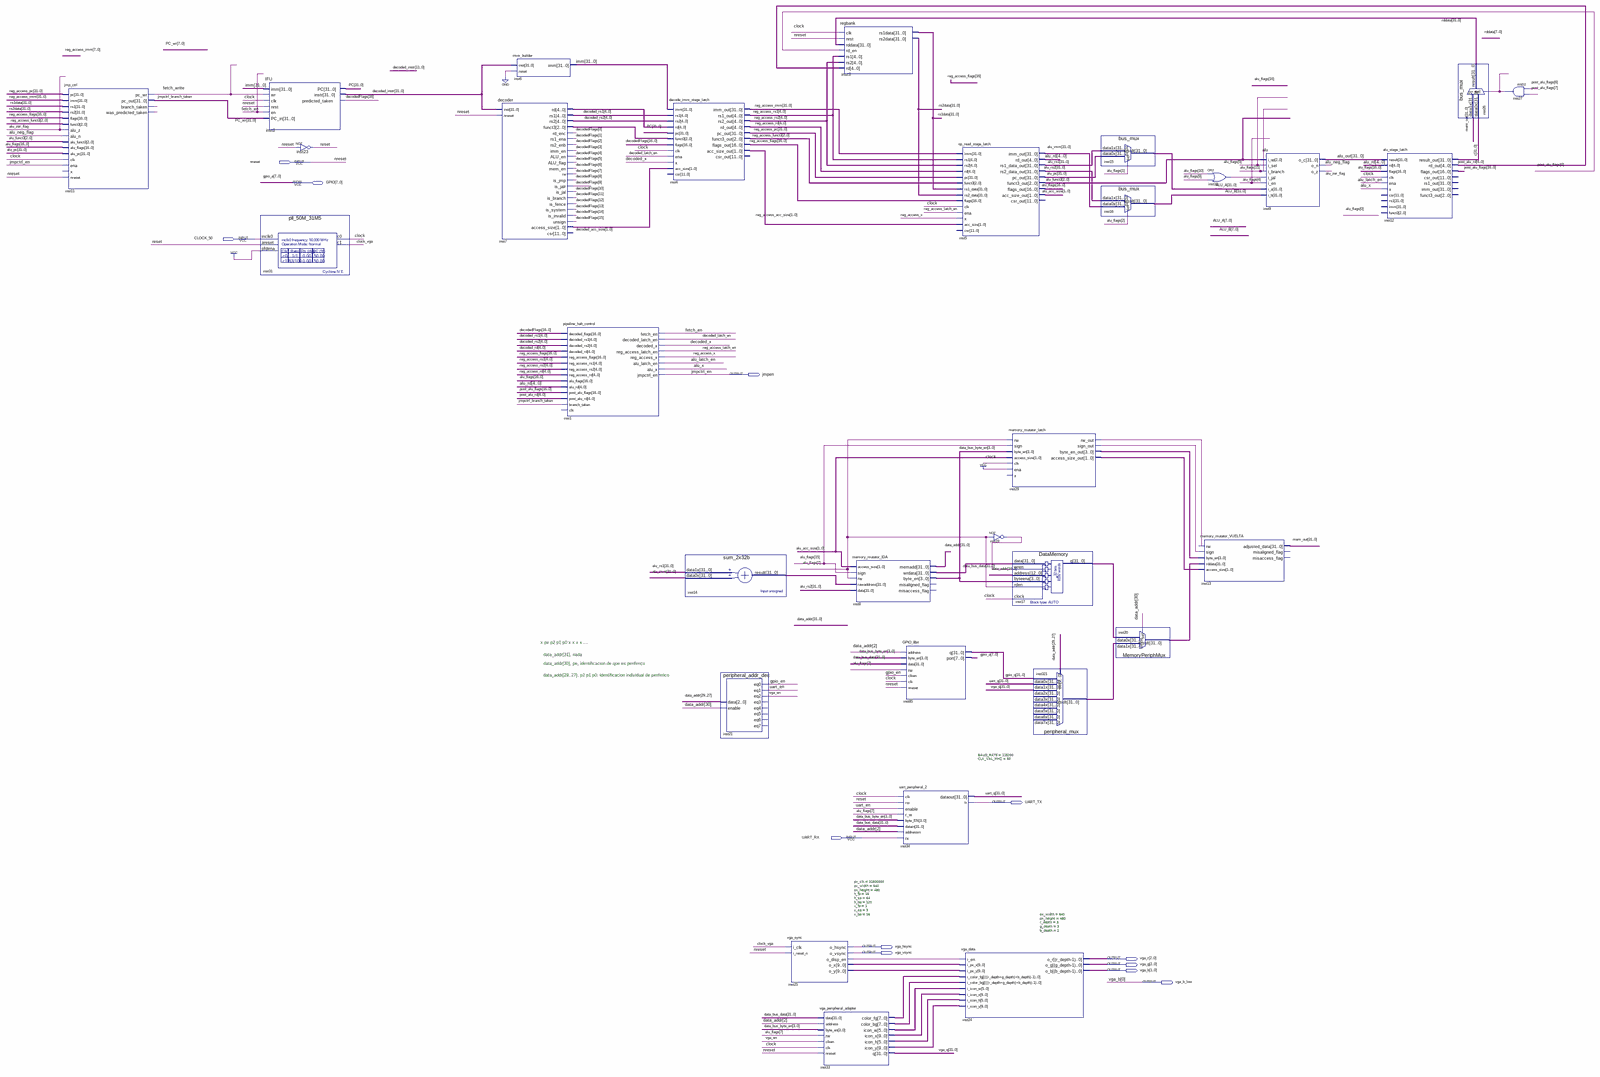
[diagram p0: schematic sheet, whole]
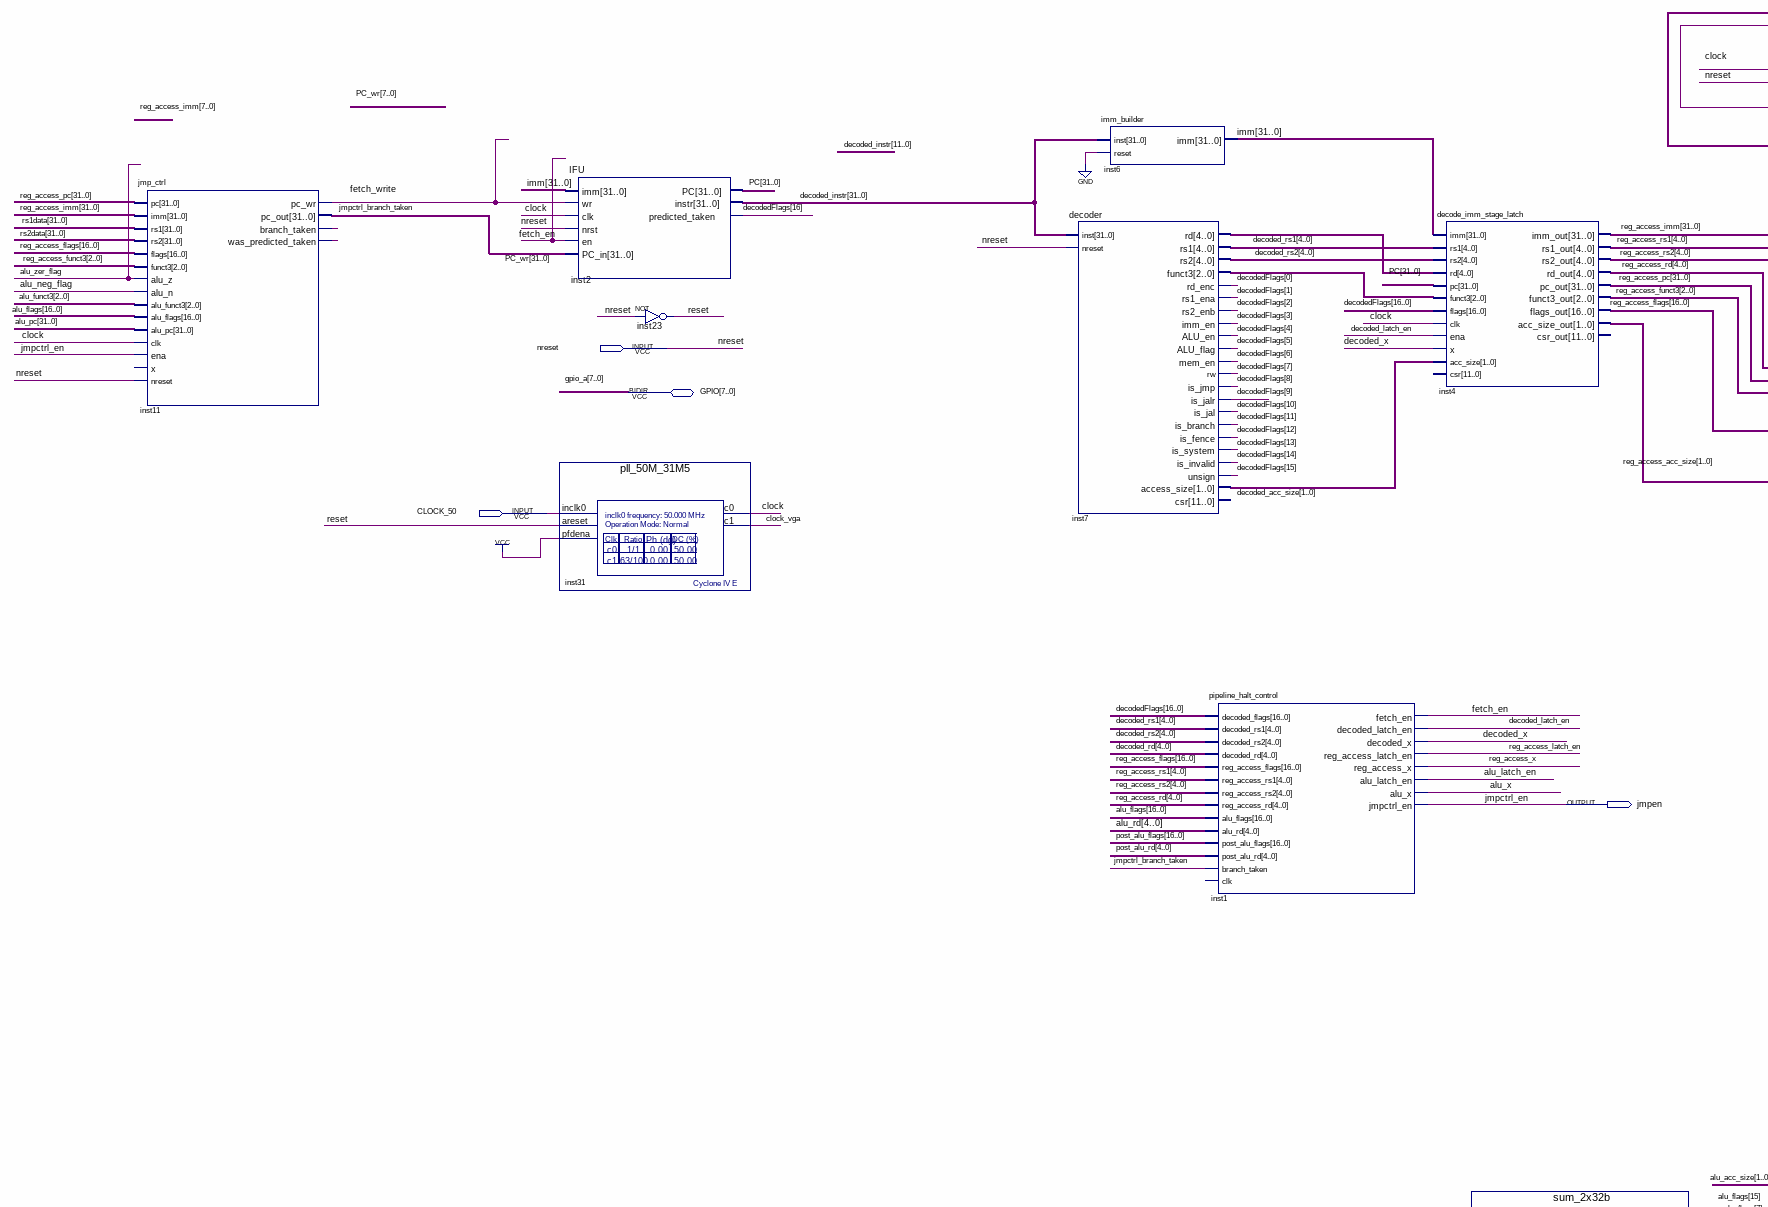
[diagram p1: schematic sheet, upper left part]
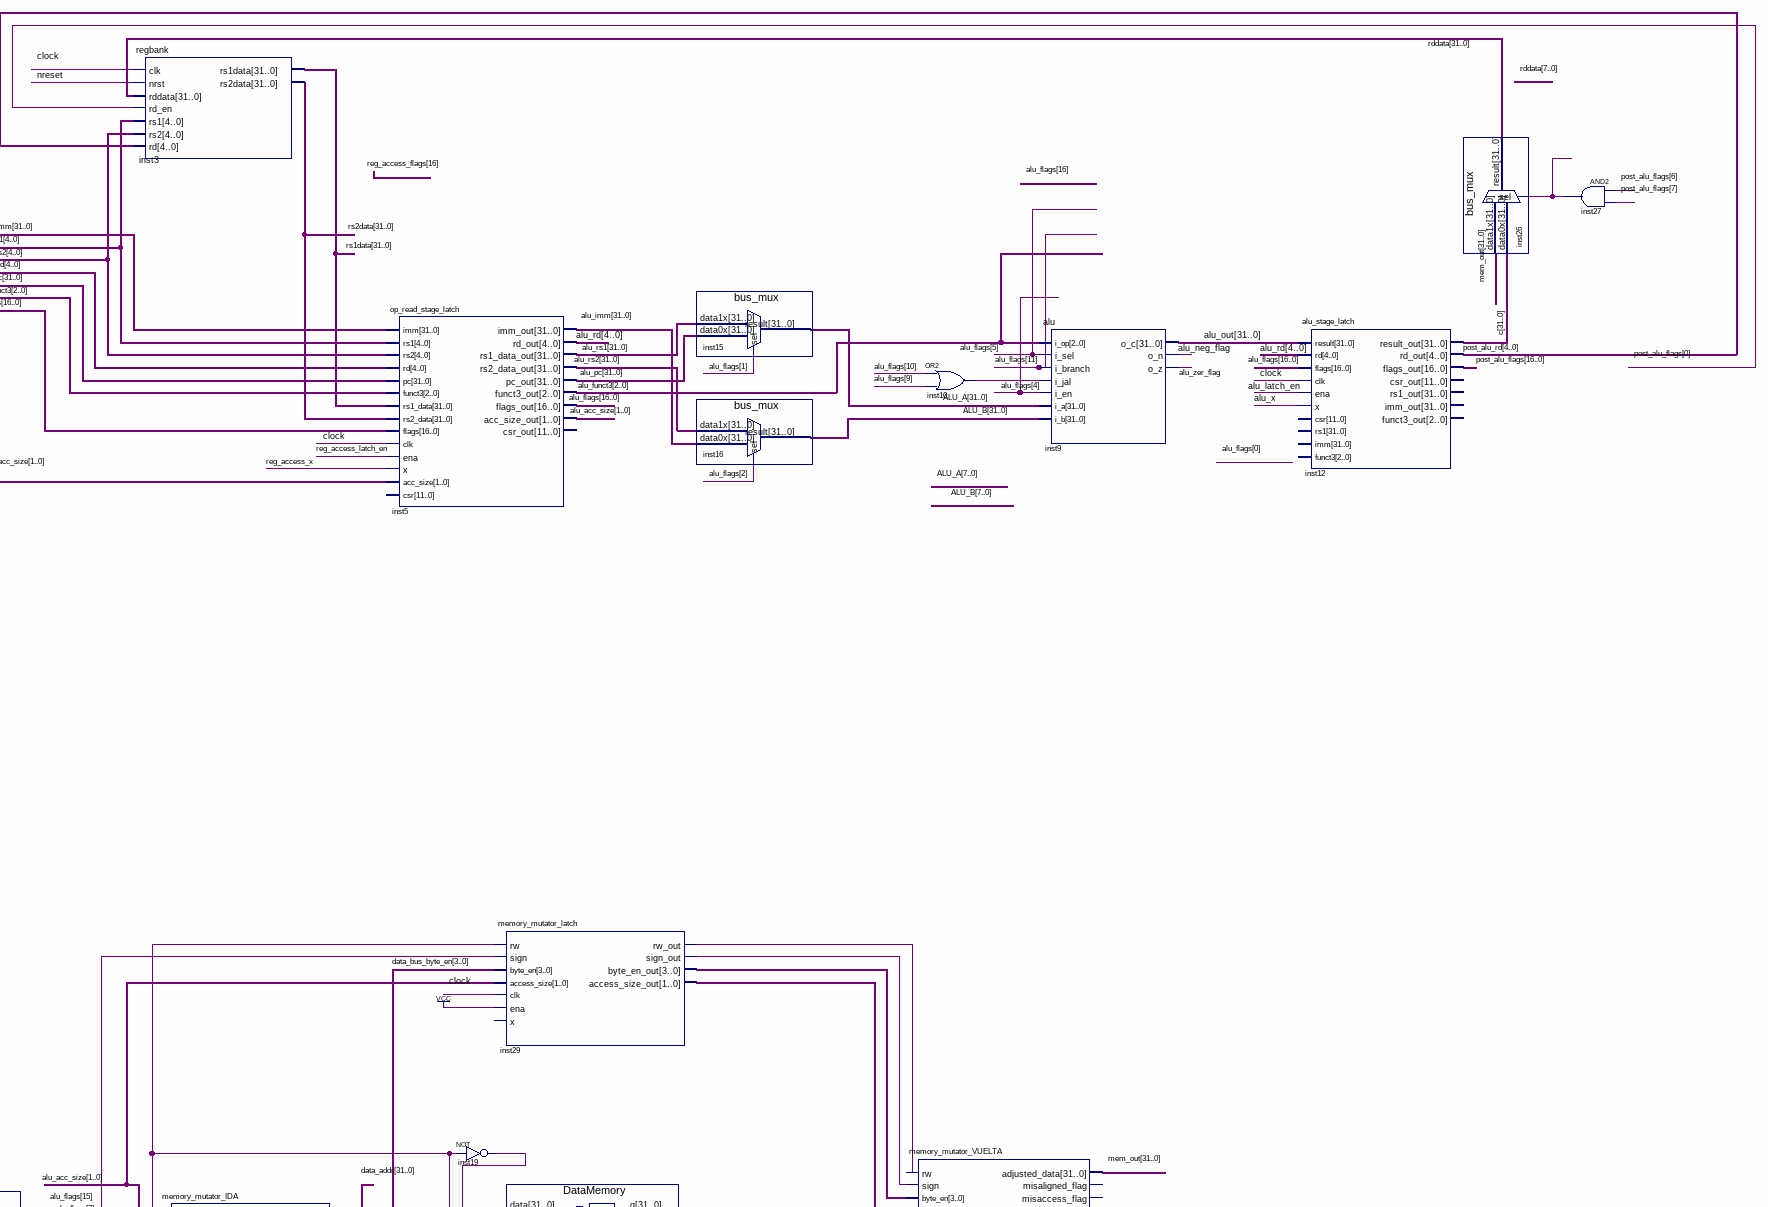
[diagram p2: schematic sheet, upper right part]
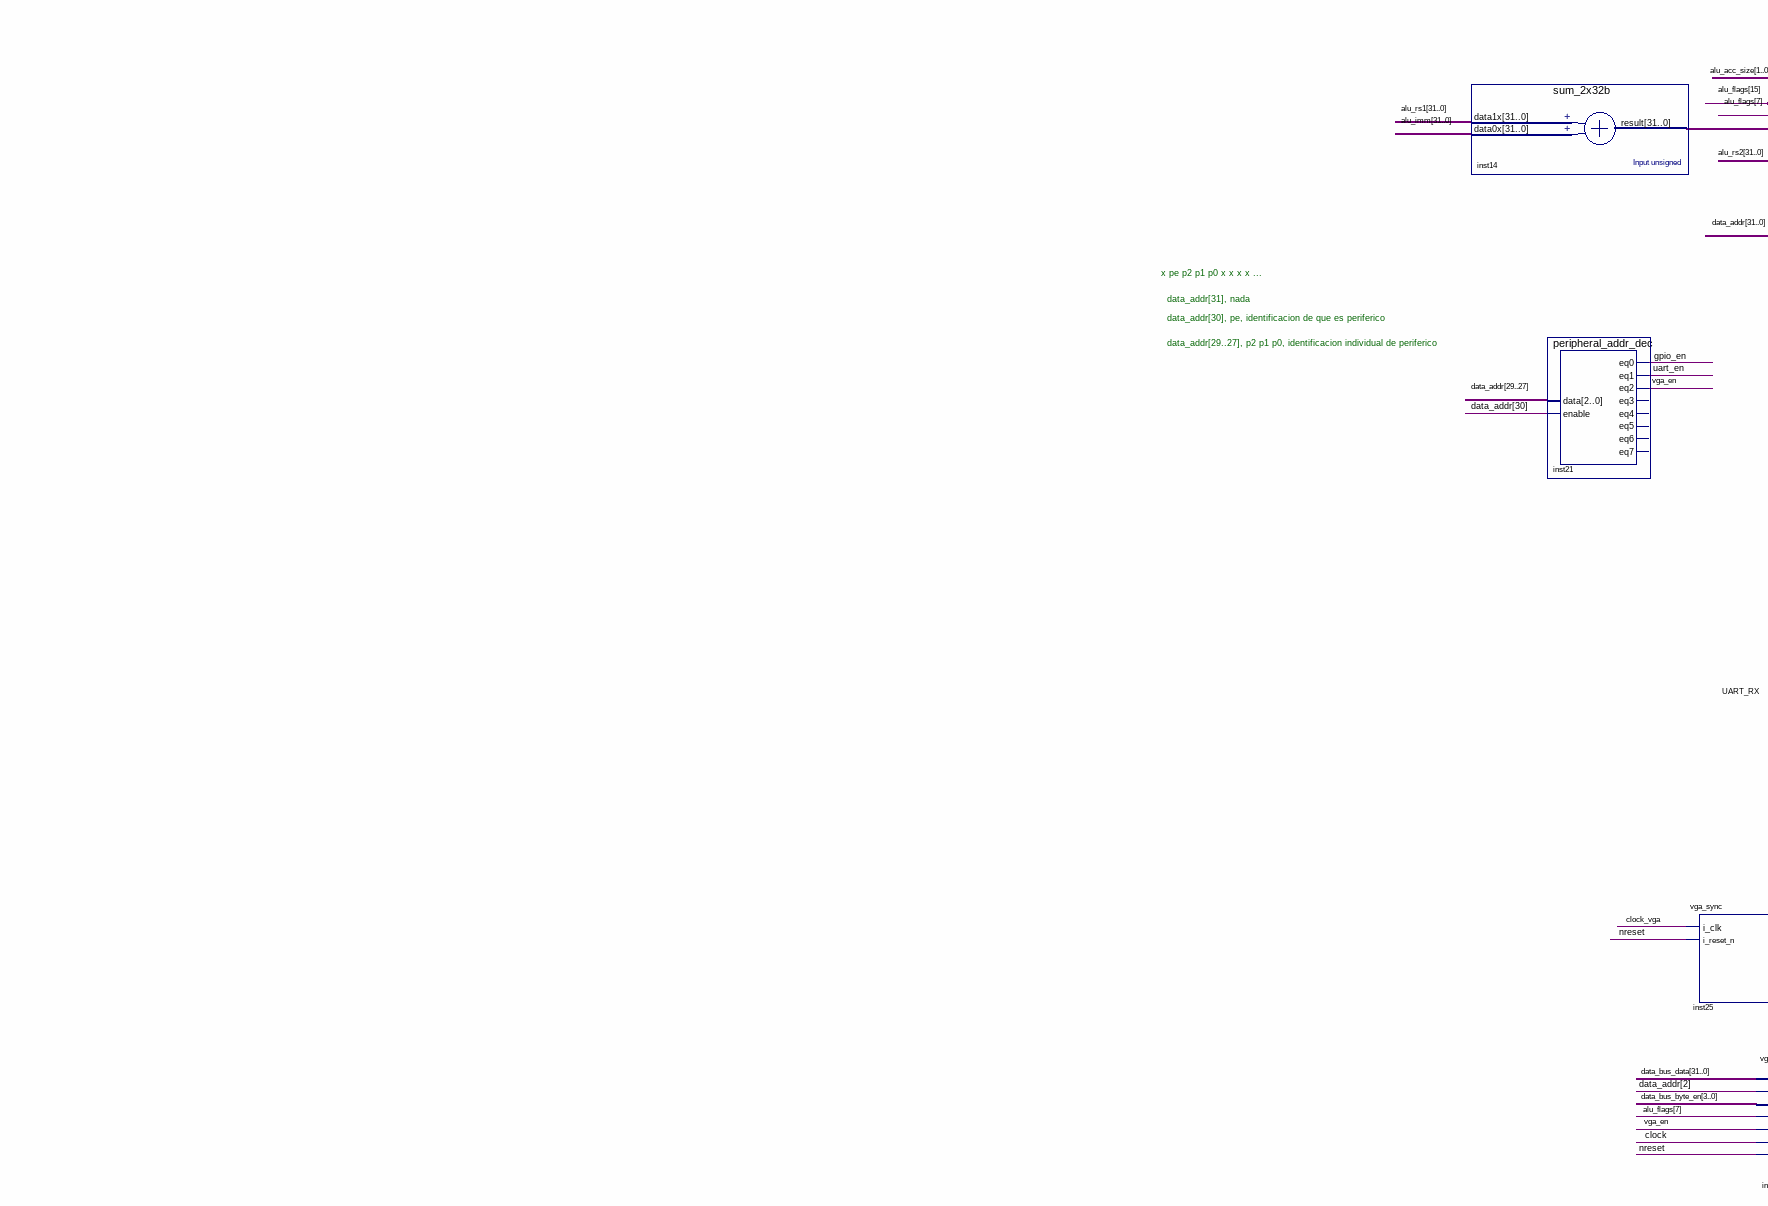
[diagram p3: schematic sheet, lower left part]
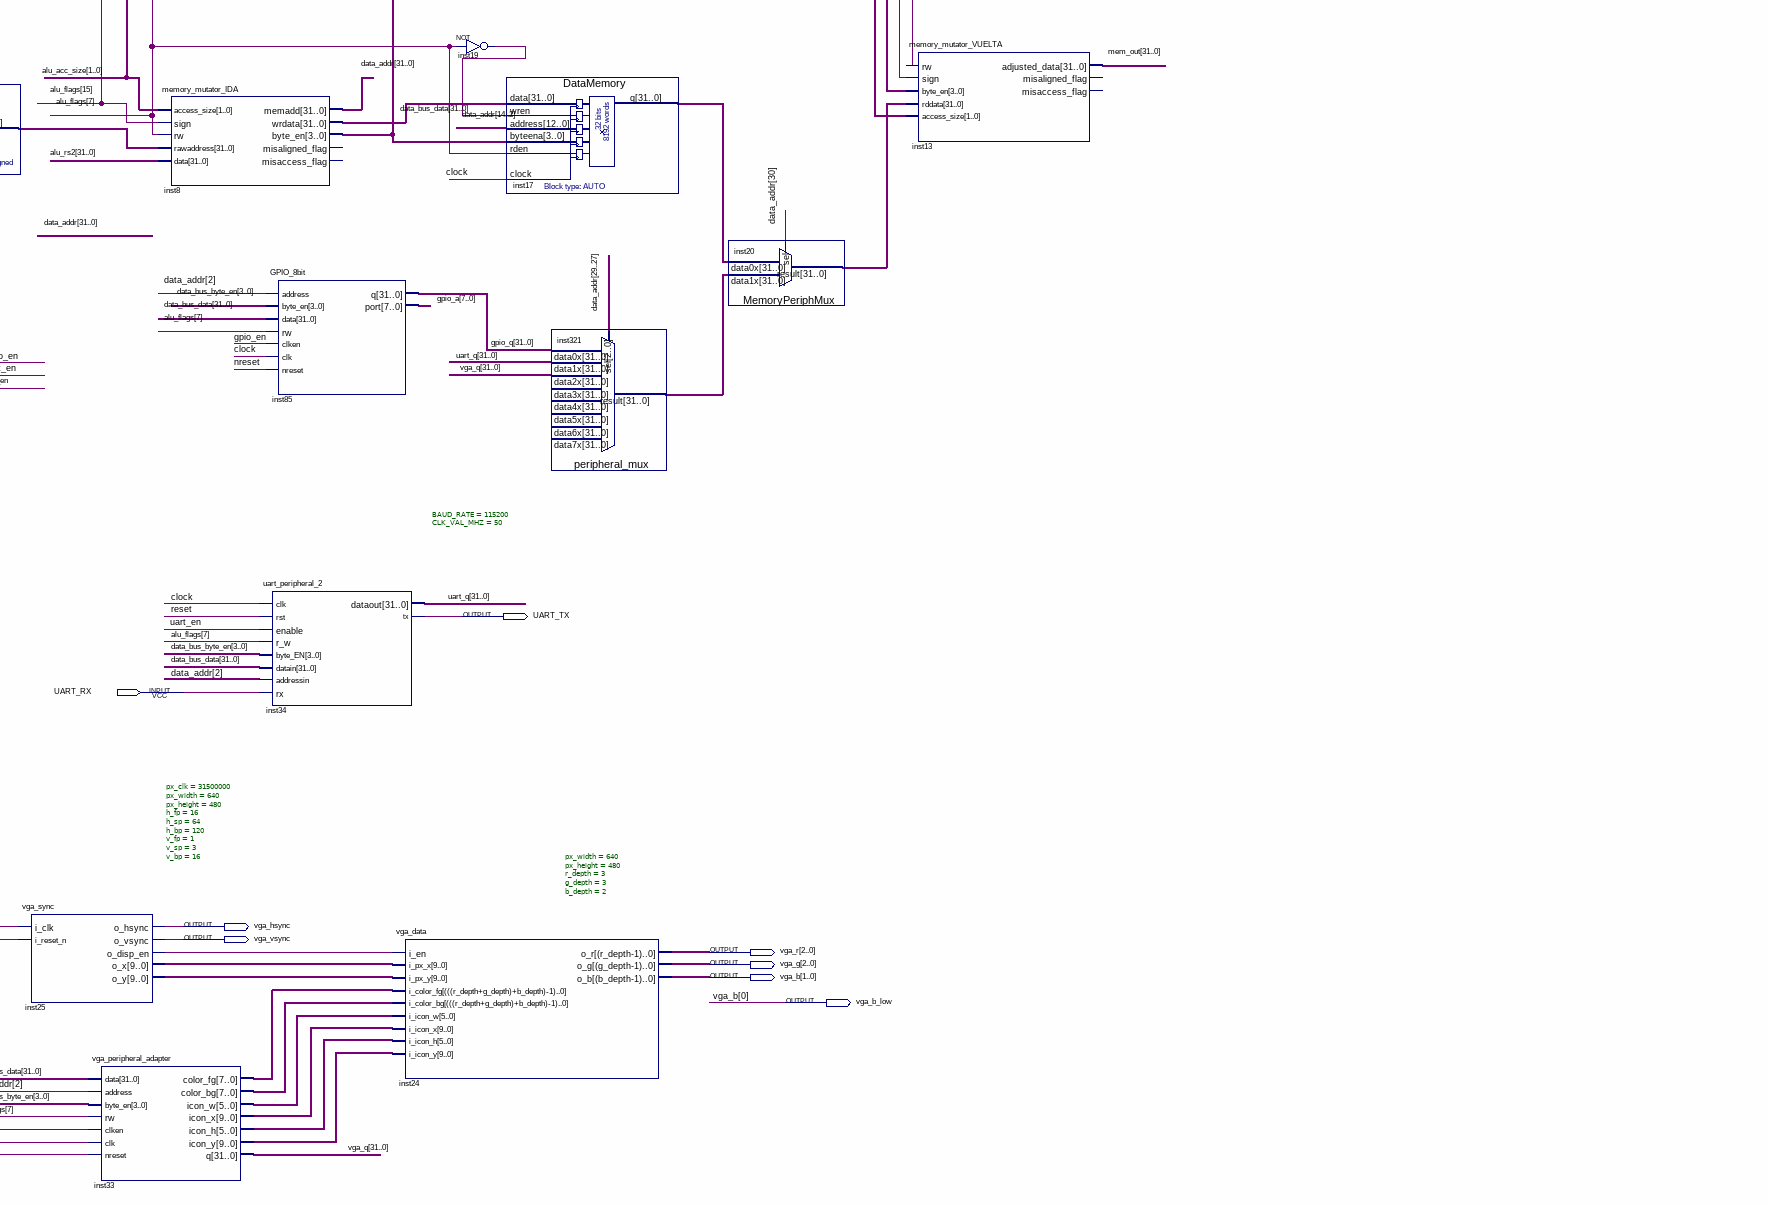
[diagram p4: schematic sheet, lower right part]
// Quartus schematic ERV24-toProgram.bdf as structural Verilog: 31 symbols, 12 pins
module \ERV24-toProgram  (
  input  nreset,
  input  CLOCK_50,
  input  UART_RX,
  inout  [7:0] GPIO,
  output jmpen,
  output UART_TX,
  output vga_hsync,
  output vga_vsync,
  output [2:0] vga_r,
  output [2:0] vga_g,
  output [1:0] vga_b,
  output vga_b_low
);

  wire alu_latch_en, alu_neg_flag, alu_x, alu_zer_flag, clock, clock_vga, decoded_latch_en, decoded_x,
       fetch_en, fetch_write, gpio_en, inst10_out, inst11_was_predicted_taken, inst19_out, inst25_o_disp_en,
       inst27_out, inst29_rw_out, inst29_sign_out, jmpctrl_branch_taken, reg_access_latch_en, reg_access_x,
       reset, uart_en, vga_en;
  wire [1:0] alu_acc_size, decoded_acc_size, inst29_access_size_out, reg_access_acc_size;
  wire [2:0] alu_funct3, inst7_funct3, reg_access_funct3;
  wire [3:0] data_bus_byte_en, inst29_byte_en_out;
  wire [4:0] alu_rd, decoded_rd, decoded_rs1, decoded_rs2, inst7_rd, post_alu_rd, reg_access_rd,
       reg_access_rs1, reg_access_rs2;
  wire [5:0] inst33_icon_h, inst33_icon_w;
  wire [7:0] inst33_color_bg, inst33_color_fg;
  wire [9:0] inst25_o_x, inst25_o_y, inst33_icon_x, inst33_icon_y;
  wire [16:0] alu_flags, decodedFlags, post_alu_flags, reg_access_flags;
  wire [31:0] ALU_A, ALU_B, alu_imm, alu_out, alu_pc, alu_rs1, alu_rs2, c, data_addr, data_bus_data,
       decoded_instr, gpio_q, imm, inst14_result, inst17_q, inst20_result, inst321_result, mem_out, PC,
       PC_wr, rddata, reg_access_imm, reg_access_pc, rs1data, rs2data, uart_q, vga_q;

  jmp_ctrl inst11 (
    .pc(reg_access_pc), .imm(reg_access_imm), .rs1(rs1data), .rs2(rs2data), .flags(reg_access_flags),
    .funct3(reg_access_funct3), .alu_z(alu_zer_flag), .alu_n(alu_neg_flag), .alu_funct3(alu_funct3),
    .alu_flags(alu_flags), .alu_pc(alu_pc), .clk(clock), .ena(jmpen), .nreset(nreset), .pc_wr(fetch_write),
    .pc_out(PC_wr), .branch_taken(jmpctrl_branch_taken), .was_predicted_taken(inst11_was_predicted_taken));  // open: x
  IFU inst2 (
    .imm(imm), .wr(fetch_write), .clk(clock), .nrst(nreset), .en(fetch_en), .PC_in(PC_wr), .PC(PC),
    .instr(decoded_instr), .predicted_taken(decodedFlags[16]));
  pll_50M_31M5 inst31 (.inclk0(CLOCK_50), .areset(reset), .pfdena(1'b1), .c0(clock), .c1(clock_vga));
  not inst23 (reset, nreset);
  decoder inst7 (
    .inst(decoded_instr), .nreset(nreset), .rd(inst7_rd), .rs1(decoded_rs1), .rs2(decoded_rs2),
    .funct3(inst7_funct3), .rd_enc(decodedFlags[0]), .rs1_ena(decodedFlags[1]), .rs2_enb(decodedFlags[2]),
    .imm_en(decodedFlags[3]), .ALU_en(decodedFlags[4]), .ALU_flag(decodedFlags[5]), .mem_en(decodedFlags[6]),
    .rw(decodedFlags[7]), .is_jmp(decodedFlags[8]), .is_jalr(decodedFlags[9]), .is_jal(decodedFlags[10]),
    .is_branch(decodedFlags[11]), .is_fence(decodedFlags[12]), .is_system(decodedFlags[13]),
    .is_invalid(decodedFlags[14]), .unsign(decodedFlags[15]), .access_size(decoded_acc_size));  // open: csr
  imm_builder inst6 (.inst(decoded_instr), .reset(1'b0), .imm(imm));
  pipeline_halt_control inst1 (
    .decoded_flags(decodedFlags), .decoded_rs1(decoded_rs1), .decoded_rs2(decoded_rs2),
    .decoded_rd(decoded_rd), .reg_access_flags(reg_access_flags), .reg_access_rs1(reg_access_rs1),
    .reg_access_rs2(reg_access_rs2), .reg_access_rd(reg_access_rd), .alu_flags(alu_flags), .alu_rd(alu_rd),
    .post_alu_flags(post_alu_flags), .post_alu_rd(post_alu_rd), .branch_taken(jmpctrl_branch_taken),
    .fetch_en(fetch_en), .decoded_latch_en(decoded_latch_en), .decoded_x(decoded_x),
    .reg_access_latch_en(reg_access_latch_en), .reg_access_x(reg_access_x), .alu_latch_en(alu_latch_en),
    .alu_x(alu_x), .jmpctrl_en(jmpen));  // open: clk
  decode_imm_stage_latch inst4 (
    .imm(imm), .rs1(decoded_rs1), .rs2(decoded_rs2), .rd(inst7_rd), .pc(PC), .funct3(inst7_funct3),
    .flags(decodedFlags), .clk(clock), .ena(decoded_latch_en), .x(decoded_x), .acc_size(decoded_acc_size),
    .imm_out(reg_access_imm), .rs1_out(reg_access_rs1), .rs2_out(reg_access_rs2), .rd_out(reg_access_rd),
    .pc_out(reg_access_pc), .funct3_out(reg_access_funct3), .flags_out(reg_access_flags),
    .acc_size_out(reg_access_acc_size));  // open: csr, csr_out
  sum_2x32b inst14 (.data1x(alu_rs1), .data0x(alu_imm), .result(inst14_result));
  peripheral_addr_dec inst21 (
    .data(data_addr[29:27]), .enable(data_addr[30]), .eq0(gpio_en), .eq1(uart_en), .eq2(vga_en));  // open: eq3, eq4, eq5, eq6, eq7
  vga_sync #(.px_clk(31500000), .px_width(640), .px_height(480), .h_fp(16), .h_sp(64), .h_bp(120), .v_fp(1), .v_sp(3), .v_bp(16)) inst25 (
    .i_clk(clock_vga), .i_reset_n(nreset), .o_hsync(vga_hsync), .o_vsync(vga_vsync),
    .o_disp_en(inst25_o_disp_en), .o_x(inst25_o_x), .o_y(inst25_o_y));
  vga_peripheral_adapter inst33 (
    .data(data_bus_data), .address(data_addr[2]), .byte_en(data_bus_byte_en), .rw(alu_flags[7]),
    .clken(vga_en), .clk(clock), .nreset(nreset), .color_fg(inst33_color_fg), .color_bg(inst33_color_bg),
    .icon_w(inst33_icon_w), .icon_x(inst33_icon_x), .icon_h(inst33_icon_h), .icon_y(inst33_icon_y), .q(vga_q));
  regbank inst3 (
    .clk(clock), .nrst(nreset), .rddata(rddata), .rd_en(post_alu_flags[0]), .rs1(reg_access_rs1),
    .rs2(reg_access_rs2), .rd(post_alu_rd), .rs1data(rs1data), .rs2data(rs2data));
  memory_mutator_IDA inst8 (
    .access_size(alu_acc_size), .sign(alu_flags[15]), .rw(alu_flags[7]), .rawaddress(inst14_result),
    .data(alu_rs2), .memadd(data_addr), .wrdata(data_bus_data), .byte_en(data_bus_byte_en));  // open: misaligned_flag, misaccess_flag
  GPIO_8bit inst85 (
    .address(data_addr[2]), .byte_en(data_bus_byte_en), .data(data_bus_data), .rw(alu_flags[7]),
    .clken(gpio_en), .clk(clock), .nreset(nreset), .q(gpio_q), .port(GPIO));
  uart_peripheral_2 #(.BAUD_RATE(115200), .CLK_VAL_MHZ(50)) inst34 (
    .clk(clock), .rst(reset), .enable(uart_en), .r_w(alu_flags[7]), .byte_EN(data_bus_byte_en),
    .datain(data_bus_data), .addressin(data_addr[2]), .rx(UART_RX), .dataout(uart_q), .tx(UART_TX));
  op_read_stage_latch inst5 (
    .imm(reg_access_imm), .rs1(reg_access_rs1), .rs2(reg_access_rs2), .rd(reg_access_rd), .pc(reg_access_pc),
    .funct3(reg_access_funct3), .rs1_data(rs1data), .rs2_data(rs2data), .flags(reg_access_flags),
    .clk(clock), .ena(reg_access_latch_en), .x(reg_access_x), .acc_size(reg_access_acc_size),
    .imm_out(alu_imm), .rd_out(alu_rd), .rs1_data_out(alu_rs1), .rs2_data_out(alu_rs2), .pc_out(alu_pc),
    .funct3_out(alu_funct3), .flags_out(alu_flags), .acc_size_out(alu_acc_size));  // open: csr, csr_out
  vga_data #(.px_width(640), .px_height(480), .r_depth(3), .g_depth(3), .b_depth(2)) inst24 (
    .i_en(inst25_o_disp_en), .i_px_x(inst25_o_x), .i_px_y(inst25_o_y), .i_color_fg(inst33_color_fg),
    .i_color_bg(inst33_color_bg), .i_icon_w(inst33_icon_w), .i_icon_x(inst33_icon_x),
    .i_icon_h(inst33_icon_h), .i_icon_y(inst33_icon_y), .o_r(vga_r), .o_g(vga_g), .o_b(vga_b));
  not inst19 (inst19_out, alu_flags[7]);
  memory_mutator_latch inst29 (
    .rw(alu_flags[7]), .sign(alu_flags[15]), .byte_en(data_bus_byte_en), .access_size(alu_acc_size),
    .clk(clock), .ena(1'b1), .rw_out(inst29_rw_out), .sign_out(inst29_sign_out),
    .byte_en_out(inst29_byte_en_out), .access_size_out(inst29_access_size_out));  // open: x
  DataMemory inst17 (
    .data(data_bus_data), .wren(inst19_out), .address(data_addr[14:2]), .byteena(data_bus_byte_en),
    .rden(alu_flags[7]), .clock(clock), .q(inst17_q));
  peripheral_mux inst321 (
    .data2x(vga_q), .data1x(uart_q), .data0x(gpio_q), .sel(data_addr[29:27]), .result(inst321_result));  // open: data7x, data6x, data5x, data4x, data3x
  bus_mux inst15 (.data1x(alu_rs1), .data0x(alu_pc), .sel(alu_flags[1]), .result(ALU_A));
  bus_mux inst16 (.data1x(alu_rs2), .data0x(alu_imm), .sel(alu_flags[2]), .result(ALU_B));
  MemoryPeriphMux inst20 (.data1x(inst321_result), .data0x(inst17_q), .sel(data_addr[30]), .result(inst20_result));
  or inst10 (inst10_out, alu_flags[10], alu_flags[9]);
  memory_mutator_VUELTA inst13 (
    .rw(inst29_rw_out), .sign(inst29_sign_out), .byte_en(inst29_byte_en_out), .rddata(inst20_result),
    .access_size(inst29_access_size_out), .adjusted_data(mem_out));  // open: misaligned_flag, misaccess_flag
  alu inst9 (
    .i_op(alu_funct3), .i_sel(alu_flags[5]), .i_branch(alu_flags[11]), .i_jal(inst10_out),
    .i_en(alu_flags[4]), .i_a(ALU_A), .i_b(ALU_B), .o_c(alu_out), .o_n(alu_neg_flag), .o_z(alu_zer_flag));
  alu_stage_latch inst12 (
    .result(alu_out), .rd(alu_rd), .flags(alu_flags), .clk(clock), .ena(alu_latch_en), .x(alu_x),
    .result_out(c), .rd_out(post_alu_rd), .flags_out(post_alu_flags));  // open: csr, rs1, imm, funct3, csr_out, rs1_out, imm_out, funct3_out
  bus_mux inst26 (.data1x(mem_out), .data0x(c), .sel(inst27_out), .result(rddata));
  and inst27 (inst27_out, post_alu_flags[6], post_alu_flags[7]);

  assign vga_b_low = vga_b[0];

  // Other names for the same wires on the sheet: gpio_a[7:0] = GPIO; jmpctrl_en = jmpen

  // Notes on the sheet:
  //   x pe p2 p1 p0 x x x x ... 
  //   data_addr[31], nada
  //   data_addr[30], pe, identificacion de que es periferico
  //   data_addr[29..27], p2 p1 p0, identificacion individual de periferico
endmodule
